# Altium schematic sheet DigitalInterface.SchDoc
size A; SheetNumber: 4; SheetTotal: 5
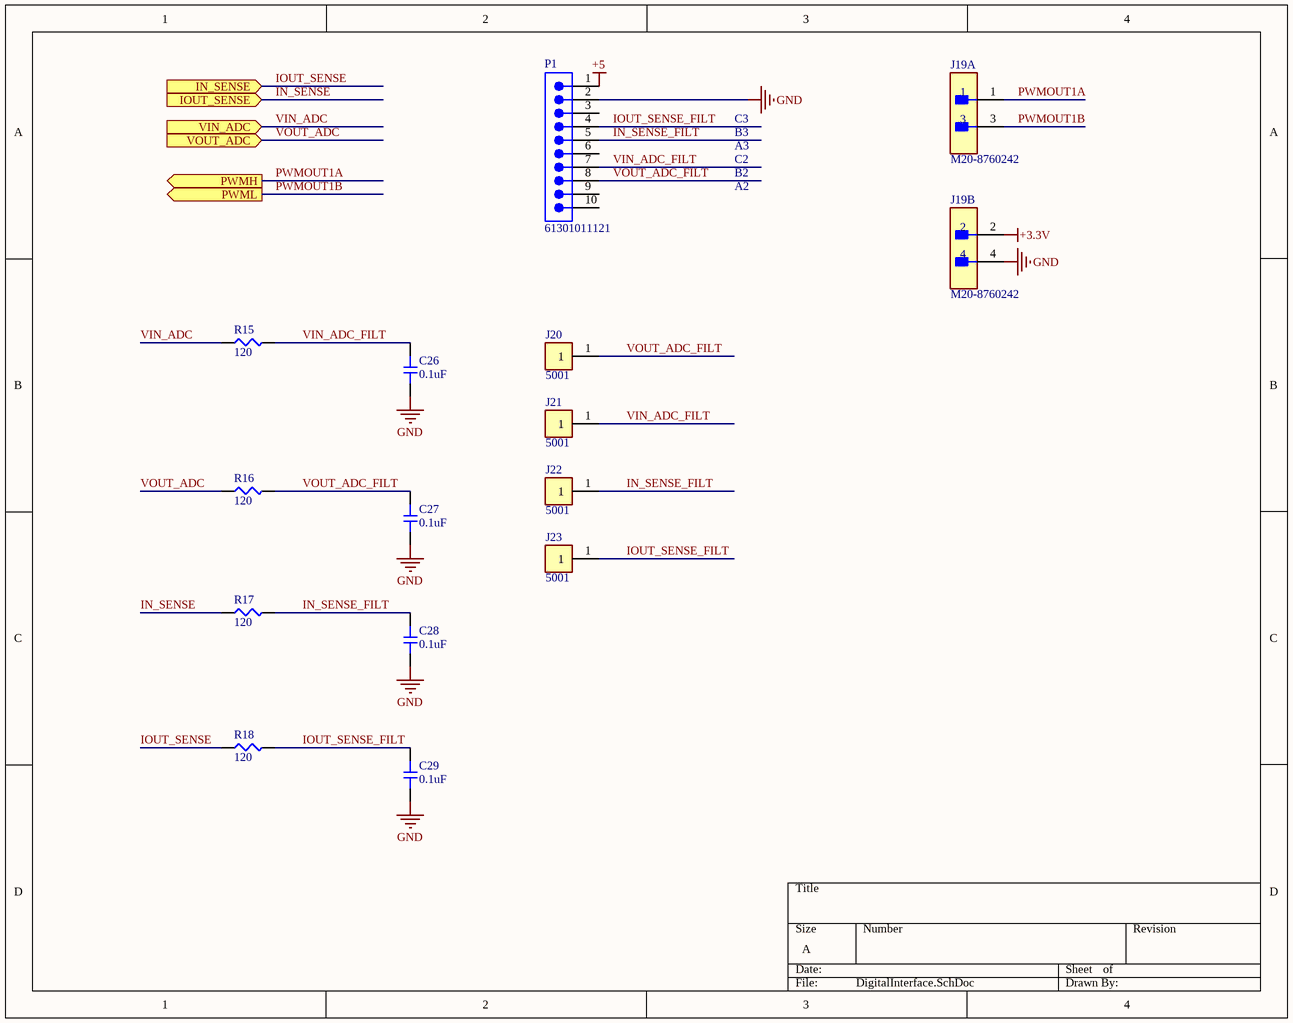
[diagram p0: DigitalInterface.SchDoc]

## Parts
C26  0.1uF
C27  0.1uF
C28  0.1uF
C29  0.1uF
J19  M20-8760242  [FP-M20-8760242-MFG]  (parts A,B of 2)
J20  5001  [FP-5001-MFG]
J21  5001  [FP-5001-MFG]
J22  5001  [FP-5001-MFG]
J23  5001  [FP-5001-MFG]
P1  61301011121  [61301011121]
R15  120  [SMD-0603-RES]
R16  120  [SMD-0603-RES]
R17  120  [SMD-0603-RES]
R18  120  [SMD-0603-RES]

## Ports
IN_SENSE (in), IOUT_SENSE (in), PWMH (out), PWML (out), VIN_ADC (in), VOUT_ADC (in)

## Nets
+3.3V: J19.2
+5: P1.1
GND: C26.1 C27.1 C28.1 C29.1 J19.4 P1.2
IN_SENSE: R17.1 ; port IOUT_SENSE
IN_SENSE_FILT: C28.2 J22.1 P1.5 R17.2
IOUT_SENSE: R18.1 ; port IN_SENSE
IOUT_SENSE_FILT: C29.2 J23.1 P1.4 R18.2
PWMOUT1A: J19.1 ; port PWMH
PWMOUT1B: J19.3 ; port PWML
VIN_ADC: R15.1 ; port VIN_ADC
VIN_ADC_FILT: C26.2 J21.1 P1.7 R15.2
VOUT_ADC: R16.1 ; port VOUT_ADC
VOUT_ADC_FILT: C27.2 J20.1 P1.8 R16.2

Not connected (* = marked no-connect by the designer): P1 3 6 9 10

## Notes on the sheet
- C3
- B3
- A3
- C2
- B2
- A2

## Library data of the parts
C26-C29 = C1608X7R1H104K080AA: 0.1uF, 0603, +/- 10%, 50V, X7R; Tolerance: +/- 10%; ID: 1; Mfg: TDK Corporation; TempOperatingMax: 125; TempOperatingMin: -55; TempStorageMax: 40; TempStorageMin: 5; Value: 0.1uF; MfgPN: C1608X7R1H104K080AA; Voltage: 50V; Material: X7R; RoHS: True; SMD: True; Footprint: 0603; Supplier 1: Digi-Key; Supplier Part Number 1: 445-1314-1-ND
J19 = CMP-15831-000048-1: CONN HEADER SMD 4POS 2.54MM; Manufacturer: Harwin; Contact Resistance: 25mR; Max Current Rating: 3A; Row Spacing: 0.1inch; Gender: Male; Number of Contacts: 4; Connector Type: Male Pin; Contact Mating Length: 0.228inch; Max Operating Temperature: 105°C; Depth: 5.08mm; Contact Material: Bronze; Packaging: Bulk; Series: M20; Radiation Hardening: No; Length: 5.08mm; Contact Type: Male Pin; Housing Material: Nylon; Pitch: 2.54mm; Color: Black; RoHS Compliant: Yes; Package Quantity: 1000; Orientation: Straight; Housing Color: Black; Min Operating Temperature: -40°C; Termination: Solder; Contact Plating: Gold; Mount: Surface Mount; Number of Rows: 2; Number of Positions: 4; Manufacturer Part Number: M20-8760242
J20-J23 = CMP-2000-05181-2: PC TEST POINT MINIATURE BLACK; Manufacturer: Keystone Electronics; Body Material: Bronze; Plating: Silver; Inside Diameter: 1.27mm; Hole Diameter: 1.6mm; Number of Ports: 1; Outside Diameter: 2.54mm; Insulation: Insulated; Insulation Material: Nylon; Mount: Through Hole; RoHS Compliant: Yes; Series: THM; Height: 0.3inch; Termination: Through Hole; Material: Nylon; Packaging: Bulk; Contact Material: Bronze; REACH SVHC: No SVHC; Contact Plating: Silver; Orientation: Straight; Lead Free: Lead Free; Package Quantity: 100; Length: 7.62mm; Flammability Rating: UL94 V-0; Number of Contacts: 1; Diameter: 2.54mm; Housing Color: Black; Color: Black; Manufacturer Part Number: 5001
P1 = CMP-1502-01082-4: NexarPartId: 18818159; Manufacturer: Wurth Electronics; Operating Supply Voltage: 250V; Insulation Resistance: 1GΩ; Contact Resistance: 20mΩ; Current Rating: 3A; Connector Type: Male Pin; Gender: Male; Number of Contacts: 10; Pitch: 2.54mm; REACH SVHC: Unknown; Min Operating Temperature: -40°C; Max Operating Temperature: 105°C; Height: 8.74mm; Packaging: Bulk; Orientation: Vertical; Number of Pins: 10; Contact Mating Length: 5.9944mm; Voltage Rating: 250V; Number of Positions: 10; Termination: Solder; Number of Rows: 1; Contact Material: Copper; Housing Material: PBT; Mount: Through Hole; Lead Pitch: 2.54mm; Contact Plating: Gold; Contact Gender: Male; Color: Black; Flammability Rating: UL94 V-0; RoHS: Compliant; Width: 25.4mm; Length: 2.54mm; Manufacturer Part Number: 61301011121
R15-R18 = ERJ-3EKF1200V: RES SMD 120 OHM 1% 1/10W 0603; Manufacturer: Panasonic Electronic Components; Factory Stock: 0; Unit Price (USD): 0.00379; @ qty: 1500; Minimum Quantity: 1; Power (Watts): 0.1W, 1/10W; Temperature Coefficient: ±100ppm/°C; Part Number: ERJ-3EKF1200V; Datasheets: http://industrial.panasonic.com/www-cgi/jvcr13pz.cgi?E+PZ+3+AOA0002+ERJ3EKF1200V+7+WW; Image: //media.digikey.com/Photos/Panasonic%20Photos/MFG_ERJ-P6W%20Series.jpg; Digi-Key Part Number: P120HCT-ND; Quantity Available: 84623; Packaging: Cut Tape (CT); Series: ERJ; Part Status: Active; Value: 120; Tolerance: ±1%; Composition: Thick Film; Features: Automotive AEC-Q200; Operating Temperature: -55°C ~ 155°C; Package / Case: 0603 (1608 Metric); Supplier Device Package: 0603; Size / Dimension: 0.063" L x 0.031" W (1.60mm x 0.80mm); Height - Seated (Max): 0.022" (0.55mm); Number of Terminations: 2; Failure Rate: -